# Altium schematic sheet 04-SX1257.SchDoc
size B; SheetNumber: 4; SheetTotal: 12
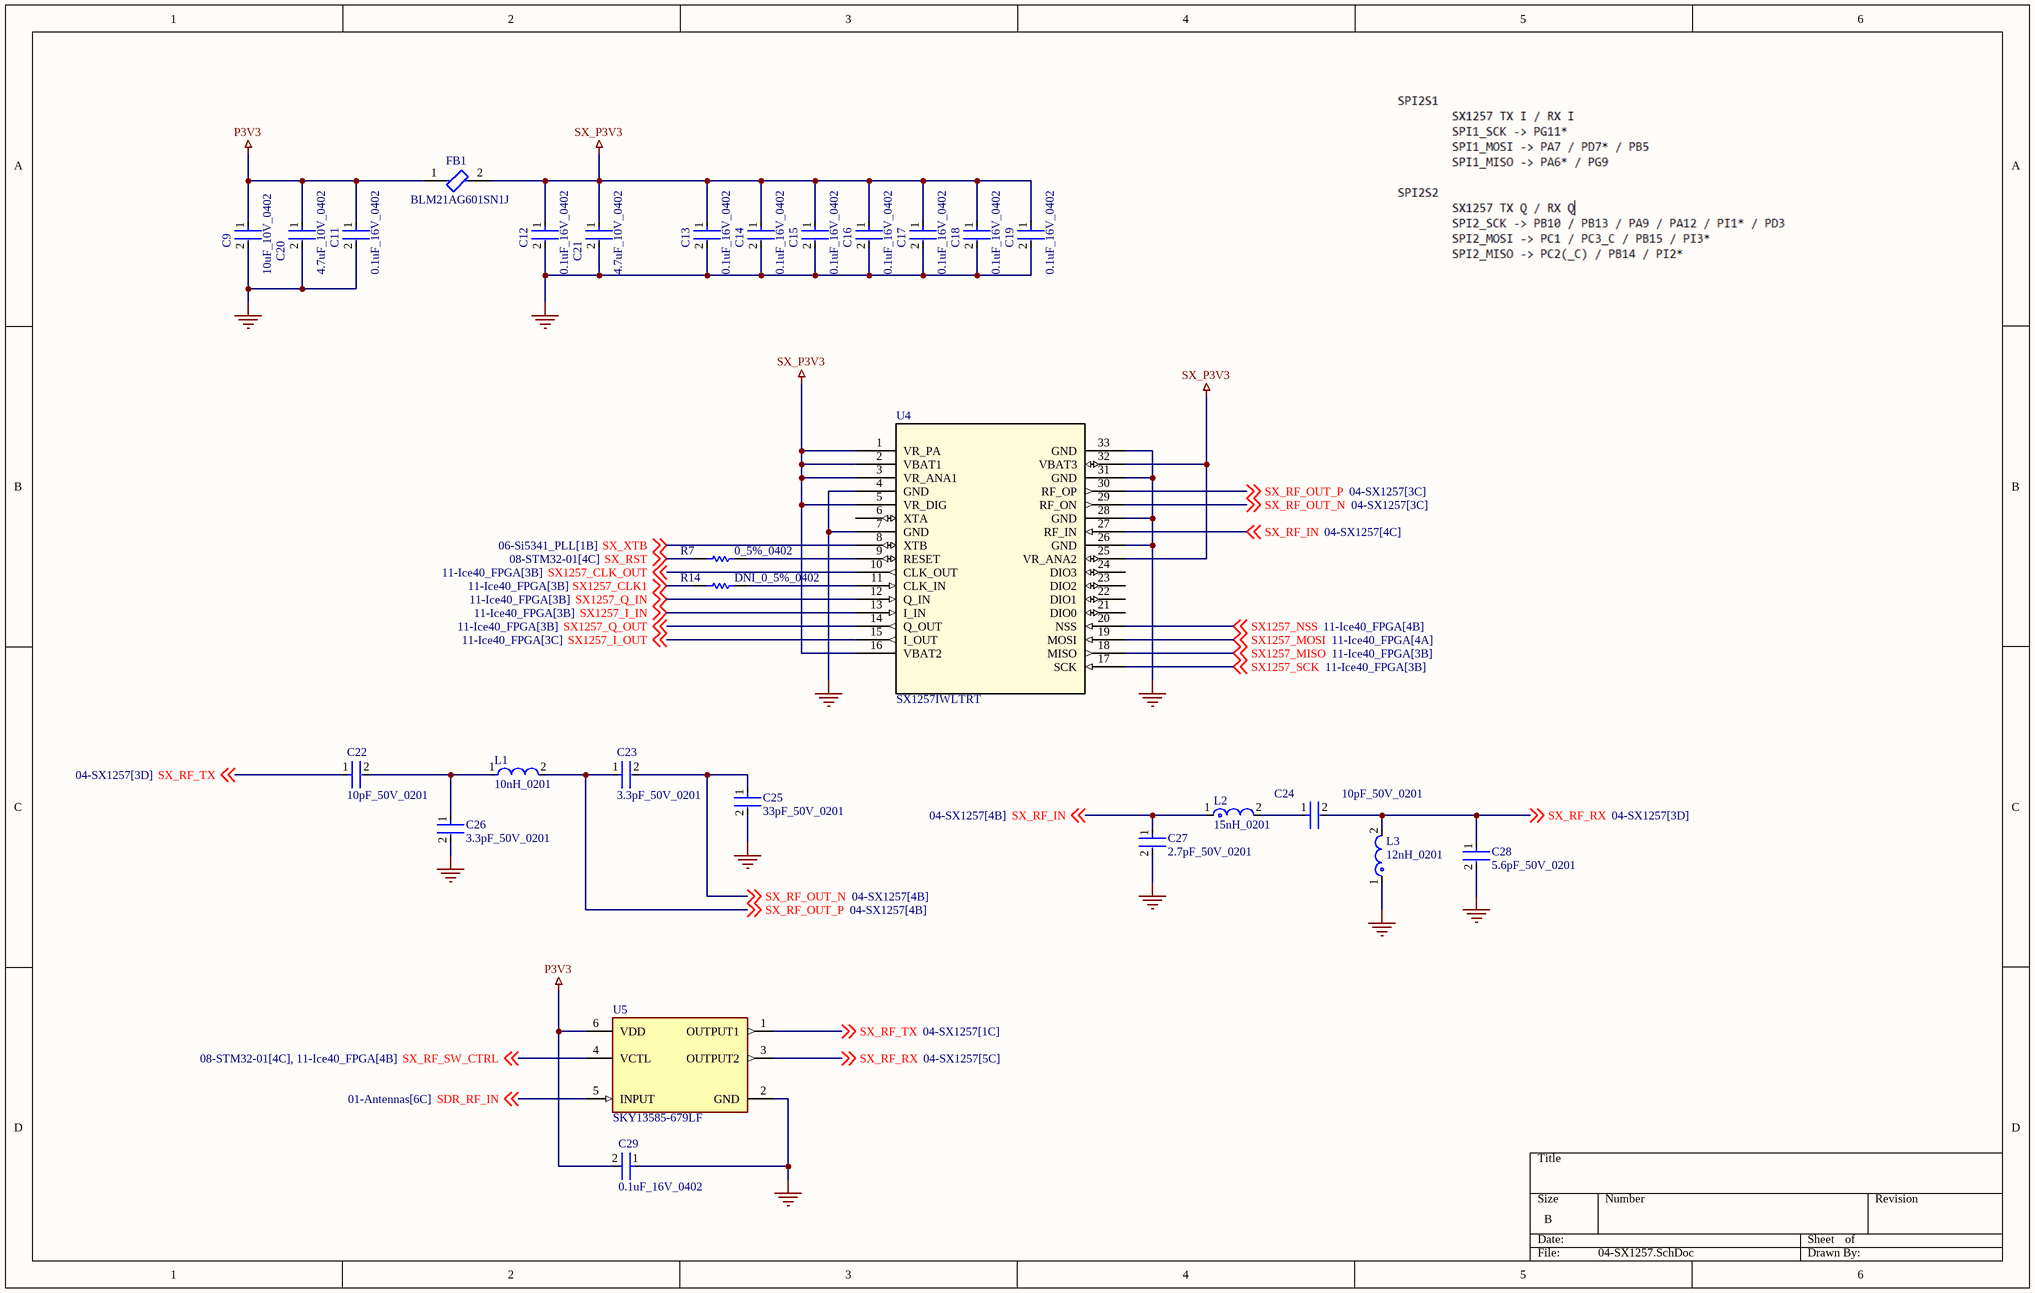
[diagram p0: 04-SX1257.SchDoc]

## Parts
C9  10uF_10V_0402  [FP-CL05A106MP5NUNC-MFG]
C11  0.1uF_16V_0402  [FP-C0402-BB-MFG]
C12  0.1uF_16V_0402  [FP-C0402-BB-MFG]
C13  0.1uF_16V_0402  [FP-C0402-BB-MFG]
C14  0.1uF_16V_0402  [FP-C0402-BB-MFG]
C15  0.1uF_16V_0402  [FP-C0402-BB-MFG]
C16  0.1uF_16V_0402  [FP-C0402-BB-MFG]
C17  0.1uF_16V_0402  [FP-C0402-BB-MFG]
C18  0.1uF_16V_0402  [FP-C0402-BB-MFG]
C19  0.1uF_16V_0402  [FP-C0402-BB-MFG]
C20  4.7uF_10V_0402  [FP-C1005-050-0_15-MFG]
C21  4.7uF_10V_0402  [FP-C1005-050-0_15-MFG]
C22  10pF_50V_0201  [FP-CGA1A-0_1-0_03-MFG]
C23  3.3pF_50V_0201  [FP-GRM033-0_03-IPC_C]
C24  10pF_50V_0201  [FP-CGA1A-0_1-0_03-MFG]
C25  33pF_50V_0201  [FP-CGA1A-0_1-0_03-MFG]
C26  3.3pF_50V_0201  [FP-GRM033-0_03-IPC_C]
C27  2.7pF_50V_0201  [FP-GRM033-0_03-IPC_C]
C28  5.6pF_50V_0201  [FP-GRM033-0_03-MFG]
C29  0.1uF_16V_0402  [FP-C0402-BB-MFG]
FB1  BLM21AG601SN1J  [FP-BLM21-0_2-t0_85-e0_5-IPC_A]
L1  10nH_0201  [FP-LQP03HQ_02-MFG]
L2  15nH_0201  [FP-LQP03TG_02-IPC_C]
L3  12nH_0201  [FP-LQP03TG_02-MFG]
R7  0_5%_0402  [RESC1005X40X25NL05T10]
R14  DNI_0_5%_0402  [RESC1005X40X25NL05T10]  (no BOM)
U4  SX1257IWLTRT  [MLPQW-32_SEM]
U5  SKY13585-679LF  [FP-SKY13585-679LF-MFG]

## Nets
GND: C9.2 C11.2 C12.2 C13.2 C14.2 C15.2 C16.2 C17.2 C18.2 C19.2 C20.2 C21.2 C25.2 C26.2 C27.2 C28.2 C29.1 L3.1 U4.4(GND) U4.7(GND) U4.26(GND) U4.28(GND) U4.31(GND) U4.33(GND) U5.2(GND)
P3V3: C9.1 C11.1 C20.1 C29.2 FB1.1 U5.6(VDD)
SX_P3V3: C12.1 C13.1 C14.1 C15.1 C16.1 C17.1 C18.1 C19.1 C21.1 FB1.2 U4.1(VR_PA) U4.2(VBAT1) U4.3(VR_ANA1) U4.5(VR_DIG) U4.16(VBAT2) U4.25(VR_ANA2) U4.32(VBAT3)
SDR_RF_IN: U5.5(INPUT) ; off-sheet SDR_RF_IN
SX1257_CLK1: R14.1 ; off-sheet SX1257_CLK1
SX1257_CLK_OUT: U4.10(CLK_OUT) ; off-sheet SX1257_CLK_OUT
SX1257_I_IN: U4.13(I_IN) ; off-sheet SX1257_I_IN
SX1257_I_OUT: U4.15(I_OUT) ; off-sheet SX1257_I_OUT
SX1257_MISO: U4.18(MISO) ; off-sheet SX1257_MISO
SX1257_MOSI: U4.19(MOSI) ; off-sheet SX1257_MOSI
SX1257_NSS: U4.20(NSS) ; off-sheet SX1257_NSS
SX1257_Q_IN: U4.12(Q_IN) ; off-sheet SX1257_Q_IN
SX1257_Q_OUT: U4.14(Q_OUT) ; off-sheet SX1257_Q_OUT
SX1257_SCK: U4.17(SCK) ; off-sheet SX1257_SCK
SX_RF_IN: C27.1 L2.1 U4.27(RF_IN) ; off-sheet SX_RF_IN
SX_RF_OUT_N: C23.2 C25.1 U4.29(RF_ON) ; off-sheet SX_RF_OUT_N
SX_RF_OUT_P: C23.1 L1.2 U4.30(RF_OP) ; off-sheet SX_RF_OUT_P
SX_RF_RX: C24.2 C28.1 L3.2 U5.3(OUTPUT2) ; off-sheet SX_RF_RX
SX_RF_SW_CTRL: U5.4(VCTL) ; off-sheet SX_RF_SW_CTRL
SX_RF_TX: C22.1 U5.1(OUTPUT1) ; off-sheet SX_RF_TX
SX_RST: R7.1 ; off-sheet SX_RST
SX_XTB: U4.8(XTB) ; off-sheet SX_XTB
NetC22_2: C22.2 C26.1 L1.1
NetC24_1: C24.1 L2.2
NetR7_2: R7.2 U4.9(RESET)
NetR14_2: R14.2 U4.11(CLK_IN)

Not connected (* = marked no-connect by the designer): U4 6(XTA) 21(DIO0) 22(DIO1) 23(DIO2) 24(DIO3)

## Library data of the parts
C9 = CMP-13271-000002-1: CAP CER 10UF 10V X5R 0402; Manufacturer Part Number: CL05A106MP5NUNC; Manufacturer: Samsung; Temperature Coefficient: 15%; Tolerance: 20%; Material: Ceramic; Octopart: https://octopart.com/cl05a106mp5nunc-samsung-22457395; Voltage Rating: 10V; RoHS: TRUE; Value: 10uF; Height: 0.7mm; Digikey Description: CAP CER 10UF 10V X5R 0402; Automotive: No; Package: CL05A106MP5NUNC; Device Class L1: Passive Components; Capacitance: 10uF; Temperature Range High: +85°C; ComponentLink2Description: Datasheet; Device Class L2: Capacitors; Temperature Characteristic: X5R; Temperature: -55°C to +85°C; ComponentLink2URL: http://www.samsungsem.com/kr/support/product-search/mlcc/__icsFiles/afieldfile/2019/05/10/19-CL05A106MP5NUNC.pdf; Device Class L3: Ceramic Capacitors; Category: Cap; Temperature Range Low: -55°C; Ipc Land Pattern Name: CAPC10050X50; Lead Free: Yes
C11-C19 C29 = CMP-1034-02068-3: CAP CER 0.1UF 16V 5% X7R 0402; Manufacturer: Kemet; Manufacturer Part Number: C0402C104J4RACTU; Value: 0.10 μF; Temperature Coefficient: 15%; Tolerance: 0.05; Material: Ceramic; ComponentLink2URL: https://content.kemet.com/datasheets/KEM_C1002_X7R_SMD.pdf; Automotive: No; Device Class L2: Capacitors; Temperature: -55°C to +125°C; RoHS: TRUE; Voltage Rating: 16 V; ComponentLink2Description: Datasheet; Device Class L3: Ceramic Capacitors; Temperature Range Low: -55°C; Ipc Land Pattern Name: CAPC10050X50; Device Class L1: Passive Components; Temperature Range High: +125°C; Package: C0402-BB; Capacitance: 0.10 μF; Category: Cap; Mouser Description: CAP CER 0.1UF 16V X7R 0402; Height: 0.55mm; Digikey Description: CAP CER 0.1UF 16V 5% X7R 0402; Octopart: https://octopart.com/c0402c104j4ractu-kemet-12573893; Temperature Characteristic: X7R; Lead Free: Yes
C20 C21 = CMP-2000-05997-2: CAP CER 4.7UF 10V X5R 0402; Dielectric Material: Ceramic; Tolerance: 10%; Series: C; Package Quantity: 10000; Max Operating Temperature: 85°C; Case Code (Imperial): 0402; Lead Free: Lead Free; Voltage Rating (DC): 10V; Packaging: Cut Tape; Voltage Rating: 10V; Min Operating Temperature: -55°C; Dielectric: X5R; Thickness: 0.022inch; Width: 0.02inch; Case/Package: 0402; Case Code (Metric): 1005; Capacitance: 4.7uF; Length: 0.039inch; RoHS Compliant: Yes; REACH SVHC: No SVHC; Mount: Surface Mount
C22 C24 = CMP-08246-000166-1: Cap Ceramic 10pF 50V C0G 0.5pF Pad SMD 0201 125°C Automotive T/R; Ratings: AEC-Q200; Length: 0.6mm; Height: 0.3mm; Case Code (Imperial): 0201; Package Quantity: 1; Dielectric: C0G; Max Operating Temperature: 125°C; Case Code (Metric): 0603; Packaging: Tape and Reel; Composition: Ceramic; Mount: Surface Mount; Depth: 0.3mm; Min Operating Temperature: -55°C; Voltage Rating (DC): 50V; Case/Package: 0201; Voltage Rating: 50V; Thickness: 0.013inch; Termination: SMD/SMT; Capacitance: 10pF; Width: 0.012inch; Weight: 6E-06oz
C23 C26 = CMP-2010-01117-2: Chip Multilayer Ceramic Capacitors for General Purpose, 0201, 3.3pF, C0G, 30ppm/°C, 0.25pF, 50V; Length: 0.024inch; Dielectric: C0G; Case Code (Imperial): 0201; Min Operating Temperature: -55°C; Mount: Surface Mount; Package Quantity: 50000; Case/Package: 0201; Voltage Rating: 50V; Termination: SMD/SMT; Thickness: 0.013inch; Width: 0.012inch; Capacitance: 3.3pF; Max Operating Temperature: 125°C; Voltage Rating (DC): 50V; Height: 0.3mm; Case Code (Metric): 0603; Packaging: Tape and Reel
C25 = CMP-08246-002436-1: Cap Ceramic 33pF 50V C0G 5% Pad SMD 0201 125°C Automotive T/R; Width: 0.012inch; Height: 0.3mm; Case Code (Imperial): 0201; Depth: 0.3mm; Weight: 6E-06oz; Package Quantity: 1; Mount: Surface Mount; Thickness: 0.013inch; Composition: Ceramic; Packaging: Tape and Reel; Dielectric: C0G; Capacitance: 33pF; Case Code (Metric): 0603; Tolerance: 5%; Length: 0.6mm; Termination: SMD/SMT; Max Operating Temperature: 125°C; Voltage Rating (DC): 50V; Ratings: AEC-Q200; Voltage Rating: 50V; Case/Package: 0201; Min Operating Temperature: -55°C
C27 = CMP-2010-01540-2: Chip Multilayer Ceramic Capacitors for General Purpose, 0201, 2.7pF, C0G, 30ppm/°C, 0.25pF, 50V; Package Quantity: 15000; Max Operating Temperature: 125°C; Dielectric: C0G; Height: 0.3mm; Voltage Rating: 50V; Packaging: Tape and Reel; Length: 0.024inch; Width: 0.012inch; Thickness: 0.013inch; Mount: Surface Mount; Case/Package: 0201; Voltage Rating (DC): 50V; Min Operating Temperature: -55°C; Case Code (Metric): 0603; Case Code (Imperial): 0201; Termination: SMD/SMT; Capacitance: 2.7pF; Lead Free: Lead Free
C28 = CMP-2010-01150-2: Chip Multilayer Ceramic Capacitors for General Purpose, 0201, 5.6pF, C0G, 30ppm/°C, 0.1pF, 50V; Depth: 0.3mm; Length: 0.6mm; Max Operating Temperature: 125°C; Mount: Surface Mount; Width: 0.012inch; Min Operating Temperature: -55°C; Case/Package: 0201; Capacitance: 5.6pF; Dielectric: C0G; Height: 0.3mm; Case Code (Imperial): 0201; Termination: SMD/SMT; Package Quantity: 15000; Case Code (Metric): 0603; Voltage Rating: 50V; Voltage Rating (DC): 50V; Thickness: 0.013inch; Packaging: Tape and Reel
FB1 = CMP-0686-00643-3: Chip Ferrite Bead, 0805, 600Ω @ 100MHz, 0.2Ω, 25%, 700mA; Current Rating: 600mA; Impedance: 600R; DC Resistance (DCR): 210mR; Max Current Rating: 200mA; Number of Circuits: 1; RoHS Compliant: Yes; Test Frequency: 100MHz; Number of Pins: 2; Case Code (Metric): 2012; Depth: 0.85mm; Height: 1.25mm; Case Code (Imperial): 0805; Case/Package: 0805; DC Current: 200mA; Max Operating Temperature: 125°C; Core Material: Ferrite; Length: 2.2mm; Tolerance: 25%; Packaging: Tape and Reel; Min Operating Temperature: -55°C; Radiation Hardening: No; Termination: Flat
L1 = CMP-06042-008104-1: Film type RF Inductor 10nH ±3% 300mA 0.4Ω 0201 (0603); Test Frequency: 500MHz; Shielding: Unshielded; Core Material: Non-Magnetic; DC Resistance (DCR): 400mR; Self Resonant Frequency: 4.5GHz; Packaging: Tape and Reel; Resistor Type: Thin Film; Min Operating Temperature: -55°C; Tolerance: 3%; Case Code (Imperial): 0201; Current Rating: 300mA; Case/Package: 0201; Max Operating Temperature: 125°C; Mount: Surface Mount; Case Code (Metric): 0603; Inductance: 10nH
L2 = CMP-06042-000019-2: Film type RF Inductor 15nH ±5% 250mA 0.7Ω 0201 (0603); Core Material: Non-Magnetic; Shielding: Unshielded; Q Factor: 12; Self Resonant Frequency: 2.6GHz; DC Resistance (DCR): 700mR; Test Frequency: 500MHz; Lead Free: Lead Free; Military Standard: Not; Case Code (Metric): 0603; Tolerance: 5%; Width: 0.3mm; Case/Package: 0201; DC Current: 250mA; Max DC Current: 250mA; Min Operating Temperature: -55°C; Inductance: 15nH; Packaging: Tape and Reel; Depth: 0.33mm; Height: 0.3mm; Termination: SMD/SMT; Package Quantity: 15000; Resistor Type: Thin Film; Case Code (Imperial): 0201; Max Operating Temperature: 125°C; Current Rating: 250mA; Height - Seated (Max): 0.013inch; Mount: Surface Mount; Length: 0.024inch
L3 = CMP-06042-011957-1: Film type RF Inductor 12nH ±5% 250mA 0.7Ω 0201 (0603); Shielding: Unshielded; Test Frequency: 500MHz; Q Factor: 12; Self Resonant Frequency: 2.9GHz; Core Material: Non-Magnetic; DC Resistance (DCR): 700mR; Package Quantity: 15000; Case/Package: 0201; Military Standard: Not; Max Operating Temperature: 125°C; Tolerance: 5%; Height - Seated (Max): 0.013inch; Case Code (Imperial): 0201; Inductance: 12nH; DC Current: 250mA; Depth: 0.33mm; Resistor Type: Thin Film; Length: 0.024inch; Lead Free: Lead Free; Radiation Hardening: No; Height: 0.3mm; Case Code (Metric): 0603; Width: 0.012inch; Mount: Surface Mount; Max DC Current: 250mA; Current Rating: 250mA; Min Operating Temperature: -55°C; Termination: SMD/SMT; Packaging: Tape and Reel
R7 R14 = CMP-2002-06457-1: Manufacturer: Panasonic; Part Number: ERJ-U020R00X
U4 = SX1257IWLTRT: No Description Available; Mfr_Name: Semtech; Type: DEV; Copyright: Copyright (C) 2023 Ultra Librarian. All rights reserved.; Manufacturer_Part_Number: SX1257IWLTRT; RefDes: RefDes
U5 = CMP-85923-000009-1: IC RF SWITCH SPDT 6GHZ 6MLPD; Insertion Loss: 0.5dB; Impedance: 50R; IIP3: 56dBm; Test Frequency: 2.5GHz; Packaging: Cut Tape; Throw Configuration: SPDT; Max Operating Temperature: 90°C; RoHS Compliant: Yes; Min Operating Temperature: -40°C; Series: -